# Altium schematic sheet fmc_interface.SchDoc
size A3
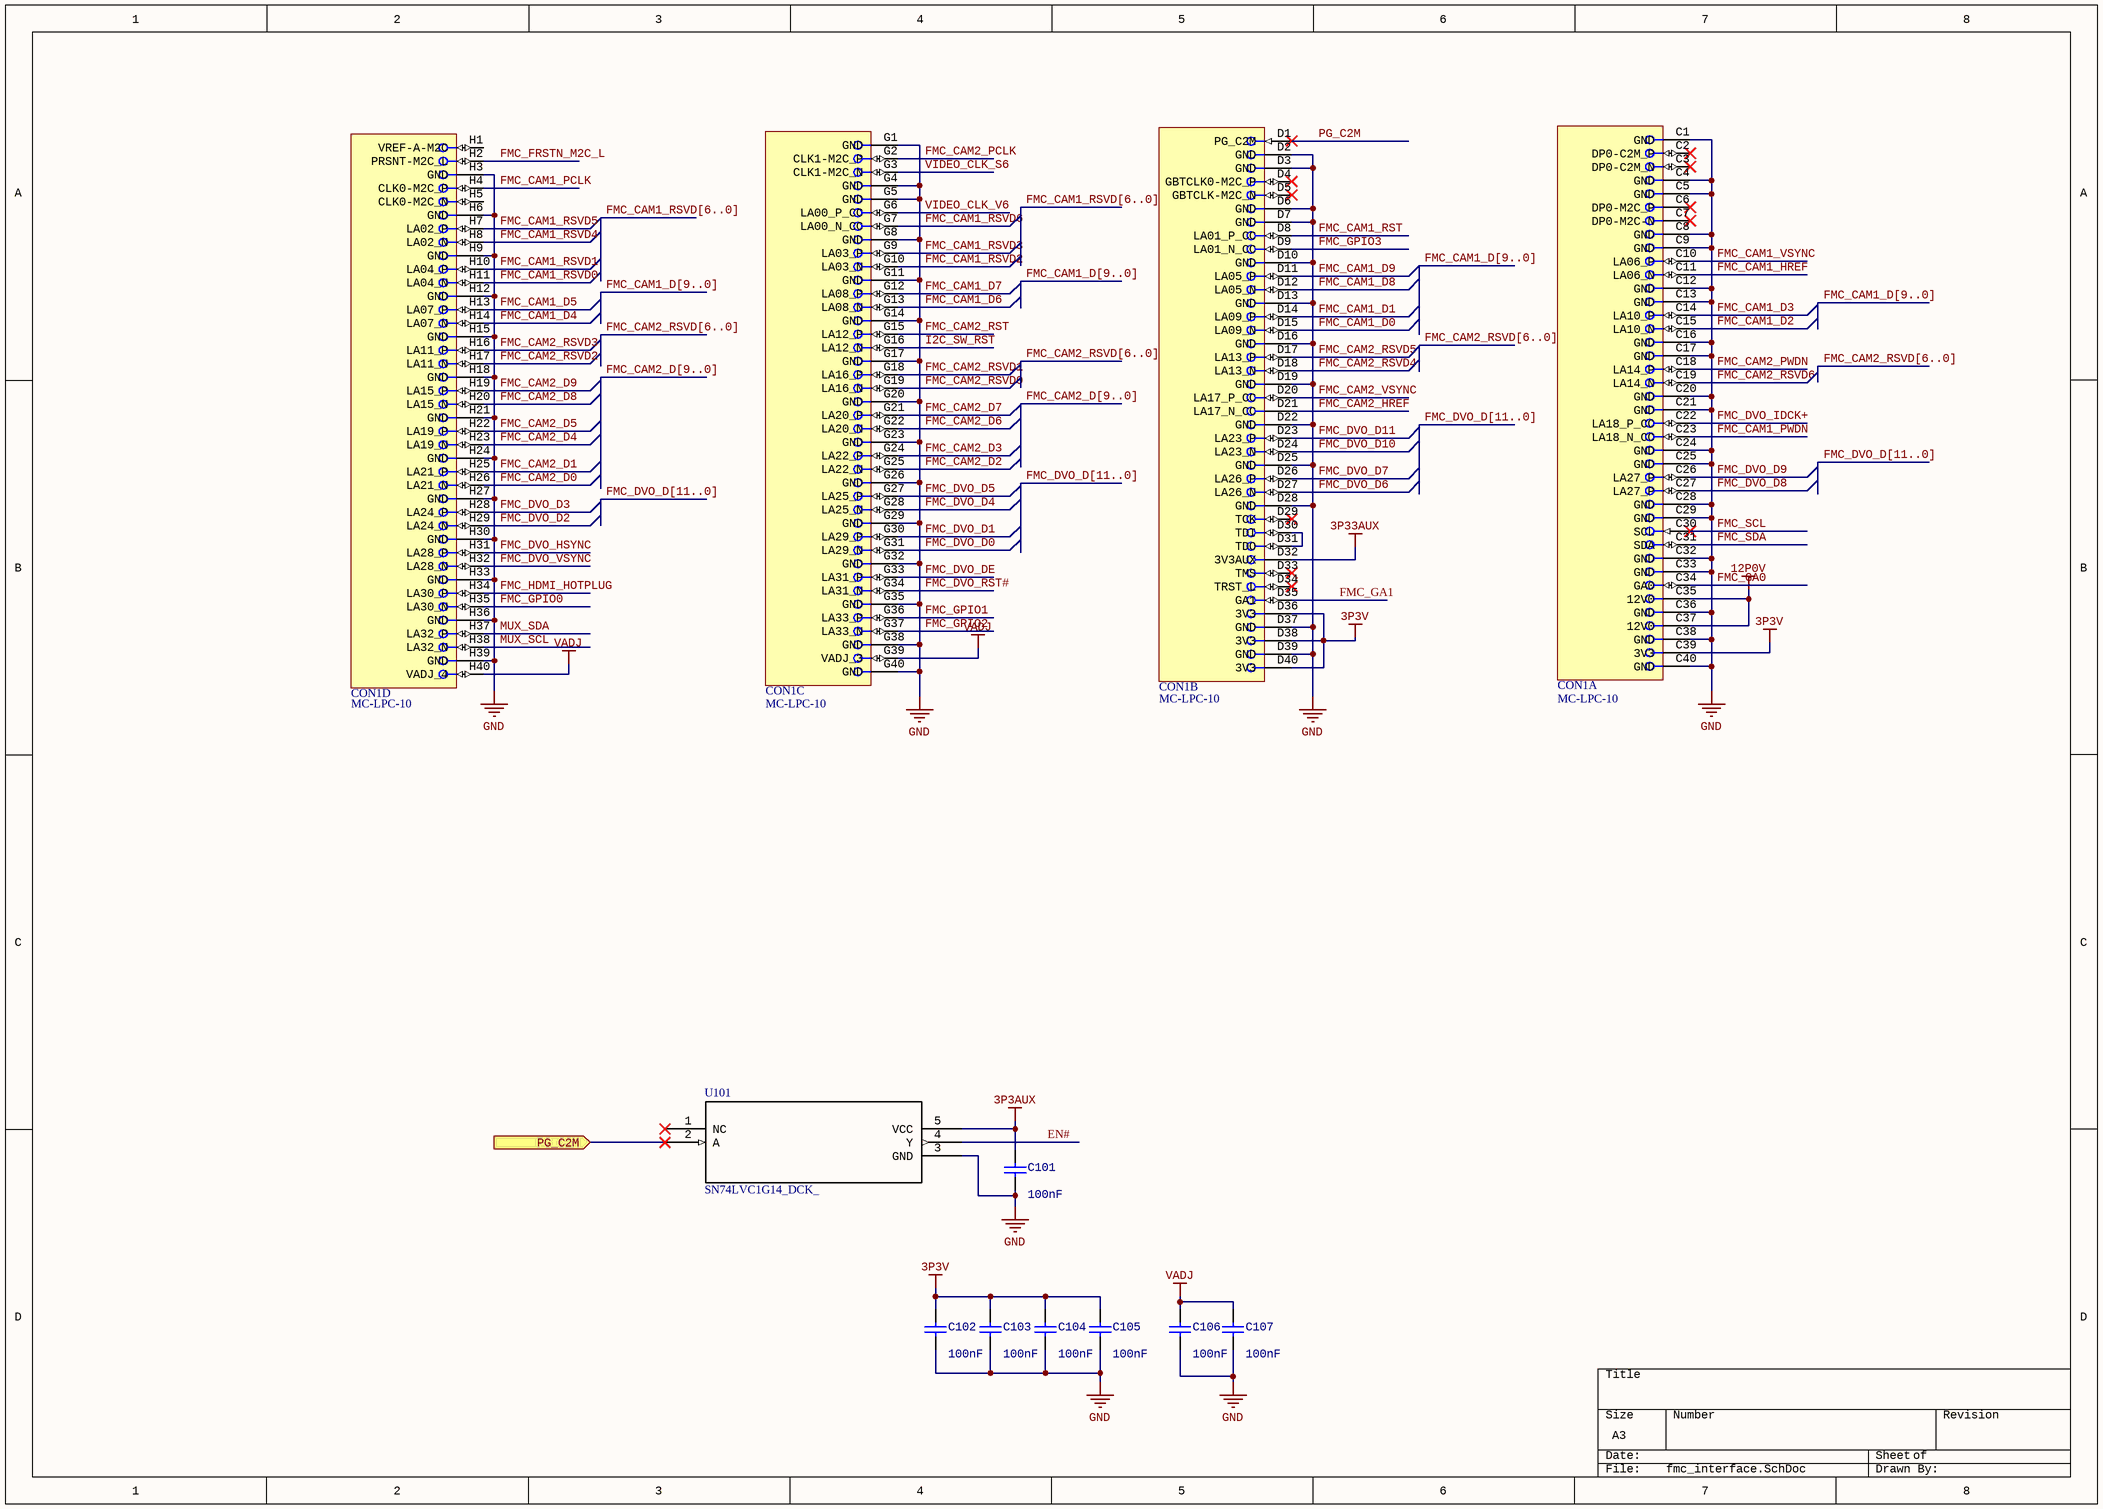
[diagram p0: fmc_interface.SchDoc]

## Parts
C101  value 100nF  [1608[0603]]  (hidden comment: Cap)
C102  value 100nF  [1608[0603]]  (hidden comment: Cap)
C103  value 100nF  [1608[0603]]  (hidden comment: Cap)
C104  value 100nF  [1608[0603]]  (hidden comment: Cap)
C105  value 100nF  [1608[0603]]  (hidden comment: Cap)
C106  value 100nF  [1608[0603]]  (hidden comment: Cap)
C107  value 100nF  [1608[0603]]  (hidden comment: Cap)
CON1  MC-LPC-10  [ASP-134604-01]  (parts A,B,C,D of 4)
U101  SN74LVC1G14_DCK_  [DCK5]

## Ports
PG_C2M (in)

## Nets
3P3AUX: C101.2 U101.5(VCC)
3P3V: C102.2 C103.2 C104.2 C105.2 CON1.C39(3V3) CON1.D36(3V3) CON1.D38(3V3) CON1.D40(3V3)
3P33AUX: CON1.D32(3V3AUX)
12P0V: CON1.C35(12V0) CON1.C37(12V0)
GND: C101.1 C102.1 C103.1 C104.1 C105.1 C106.1 C107.1 CON1.C1(GND) CON1.C4(GND) CON1.C5(GND) CON1.C8(GND) CON1.C9(GND) CON1.C12(GND) CON1.C13(GND) CON1.C16(GND) CON1.C17(GND) CON1.C20(GND) CON1.C21(GND) CON1.C24(GND) CON1.C25(GND) CON1.C28(GND) CON1.C29(GND) CON1.C32(GND) CON1.C33(GND) CON1.C36(GND) CON1.C38(GND) CON1.C40(GND) CON1.D2(GND) CON1.D3(GND) CON1.D6(GND) CON1.D7(GND) CON1.D10(GND) CON1.D13(GND) CON1.D16(GND) CON1.D19(GND) CON1.D22(GND) CON1.D25(GND) CON1.D28(GND) CON1.D37(GND) CON1.D39(GND) CON1.G1(GND) CON1.G4(GND) CON1.G5(GND) CON1.G8(GND) CON1.G11(GND) CON1.G14(GND) CON1.G17(GND) CON1.G20(GND) CON1.G23(GND) CON1.G26(GND) CON1.G29(GND) CON1.G32(GND) CON1.G35(GND) CON1.G38(GND) CON1.G40(GND) CON1.H3(GND) CON1.H6(GND) CON1.H9(GND) CON1.H12(GND) CON1.H15(GND) CON1.H18(GND) CON1.H21(GND) CON1.H24(GND) CON1.H27(GND) CON1.H30(GND) CON1.H33(GND) CON1.H36(GND) CON1.H39(GND) U101.3(GND)
VADJ: C106.2 C107.2 CON1.G39(VADJ_3) CON1.H40(VADJ_4)
EN#: U101.4(Y)
FMC_CAM1_D0: CON1.D15(LA09_N)
FMC_CAM1_D1: CON1.D14(LA09_P)
FMC_CAM1_D2: CON1.C15(LA10_N)
FMC_CAM1_D3: CON1.C14(LA10_P)
FMC_CAM1_D4: CON1.H14(LA07_N)
FMC_CAM1_D5: CON1.H13(LA07_P)
FMC_CAM1_D6: CON1.G13(LA08_N)
FMC_CAM1_D7: CON1.G12(LA08_P)
FMC_CAM1_D8: CON1.D12(LA05_N)
FMC_CAM1_D9: CON1.D11(LA05_P)
FMC_CAM1_HREF: CON1.C11(LA06_N)
FMC_CAM1_PCLK: CON1.H4(CLK0-M2C_P)
FMC_CAM1_PWDN: CON1.C23(LA18_N_CC)
FMC_CAM1_RST: CON1.D8(LA01_P_CC)
FMC_CAM1_RSVD0: CON1.H11(LA04_N)
FMC_CAM1_RSVD1: CON1.H10(LA04_P)
FMC_CAM1_RSVD2: CON1.G10(LA03_N)
FMC_CAM1_RSVD3: CON1.G9(LA03_P)
FMC_CAM1_RSVD4: CON1.H8(LA02_N)
FMC_CAM1_RSVD5: CON1.H7(LA02_P)
FMC_CAM1_RSVD6: CON1.G7(LA00_N_CC)
FMC_CAM1_VSYNC: CON1.C10(LA06_P)
FMC_CAM2_D0: CON1.H26(LA21_N)
FMC_CAM2_D1: CON1.H25(LA21_P)
FMC_CAM2_D2: CON1.G25(LA22_N)
FMC_CAM2_D3: CON1.G24(LA22_P)
FMC_CAM2_D4: CON1.H23(LA19_N)
FMC_CAM2_D5: CON1.H22(LA19_P)
FMC_CAM2_D6: CON1.G22(LA20_N)
FMC_CAM2_D7: CON1.G21(LA20_P)
FMC_CAM2_D8: CON1.H20(LA15_N)
FMC_CAM2_D9: CON1.H19(LA15_P)
FMC_CAM2_HREF: CON1.D21(LA17_N_CC)
FMC_CAM2_PCLK: CON1.G2(CLK1-M2C_P)
FMC_CAM2_PWDN: CON1.C18(LA14_P)
FMC_CAM2_RST: CON1.G15(LA12_P)
FMC_CAM2_RSVD0: CON1.G19(LA16_N)
FMC_CAM2_RSVD1: CON1.G18(LA16_P)
FMC_CAM2_RSVD2: CON1.H17(LA11_N)
FMC_CAM2_RSVD3: CON1.H16(LA11_P)
FMC_CAM2_RSVD4: CON1.D18(LA13_N)
FMC_CAM2_RSVD5: CON1.D17(LA13_P)
FMC_CAM2_RSVD6: CON1.C19(LA14_N)
FMC_CAM2_VSYNC: CON1.D20(LA17_P_CC)
FMC_DVO_D0: CON1.G31(LA29_N)
FMC_DVO_D1: CON1.G30(LA29_P)
FMC_DVO_D2: CON1.H29(LA24_N)
FMC_DVO_D3: CON1.H28(LA24_P)
FMC_DVO_D4: CON1.G28(LA25_N)
FMC_DVO_D5: CON1.G27(LA25_P)
FMC_DVO_D6: CON1.D27(LA26_N)
FMC_DVO_D7: CON1.D26(LA26_P)
FMC_DVO_D8: CON1.C27(LA27_P)
FMC_DVO_D9: CON1.C26(LA27_P)
FMC_DVO_D10: CON1.D24(LA23_N)
FMC_DVO_D11: CON1.D23(LA23_P)
FMC_DVO_DE: CON1.G33(LA31_P)
FMC_DVO_HSYNC: CON1.H31(LA28_P)
FMC_DVO_IDCK+: CON1.C22(LA18_P_CC)
FMC_DVO_RST#: CON1.G34(LA31_N)
FMC_DVO_VSYNC: CON1.H32(LA28_N)
FMC_FRSTN_M2C_L: CON1.H2(PRSNT-M2C_L)
FMC_GA0: CON1.C34(GA0)
FMC_GA1: CON1.D35(GA1)
FMC_GPIO0: CON1.H35(LA30_N)
FMC_GPIO1: CON1.G36(LA33_P)
FMC_GPIO2: CON1.G37(LA33_N)
FMC_GPIO3: CON1.D9(LA01_N_CC)
FMC_HDMI_HOTPLUG: CON1.H34(LA30_P)
FMC_SCL: CON1.C30(SCL)
FMC_SDA: CON1.C31(SDA)
I2C_SW_RST: CON1.G16(LA12_N)
MUX_SCL: CON1.H38(LA32_N)
MUX_SDA: CON1.H37(LA32_P)
PG_C2M: U101.2(A) ; port PG_C2M
PG_C2M: CON1.D1(PG_C2M)  [a separate net that carries the same name]
VIDEO_CLK_S6: CON1.G3(CLK1-M2C_N)
VIDEO_CLK_V6: CON1.G6(LA00_P_CC)
NetCON1_D30: CON1.D30(TDI) CON1.D31(TDO)

Not connected (* = marked no-connect by the designer): CON1 C2(DP0-C2M_P)* C3(DP0-C2M_N)* C6(DP0-M2C_P)* C7(DP0-M2C-N)* D4(GBTCLK0-M2C_P)* D5(GBTCLK-M2C_N)* D29(TCK)* D33(TMS)* D34(TRST_L)* H1(VREF-A-M2C) H5(CLK0-M2C_N); U101 1(NC)*

## Buses and harness runs
bus FMC_CAM1_D[9..0]
bus FMC_CAM1_RSVD[6..0]
bus FMC_CAM2_D[9..0]
bus FMC_CAM2_RSVD[6..0]
bus FMC_DVO_D[11..0]

## Library data of the parts
C101-C107 = Cap Semi: Capacitor (Semiconductor SIM Model); Published: 8-Jun-2000; LatestRevisionDate: 29-May-2009; LatestRevisionNote: IPC-7351 Footprint Added.; PackageReference: C1206; Publisher: Altium Limited; PackageDescription: Chip Capacitor
CON1 = CONNECTOR_VITA57_LPC: Connector VITA57 LPC; Manufacturer: Samtec; Specific: 4x40 contacts, stack height 10 mm; Type: Terminal (Module Side); Part Description: Connector VITA57 LPC; Part Number: ASP-134604-01; Distributor: Sibalco, Samtec; Distributor Part Number: ASP-134604-01; Value: MC-LPC-10; Supplier 1: Digi-Key; Supplier Part Number 1: SAM8732-ND
U101 = SN74LVC1G14_DCK_: Imported; Manufacturer: Texas Instruments; Manufacturer_Part_Number: sn74lvc1g14_dck_5; INDUSTRY_STD_PKG_TYPE: SC70; FAMILY_NAME: LL INVERTER; PIN_COUNT: 5; PACKAGE_DESIGNATOR: DCK; Datasheet URL: http://www.ti.com/lit/gpn/SN74LVC1G14; GENERIC_PART_NUMBER: SN74LVC1G14; Vendor: Texas Instruments; RefDes: RefDes; Type: DEV; Value: Value